# Altium schematic sheet STM32G070RBT6.SchDoc
size A4; SheetNumber: 30; SheetTotal: 32
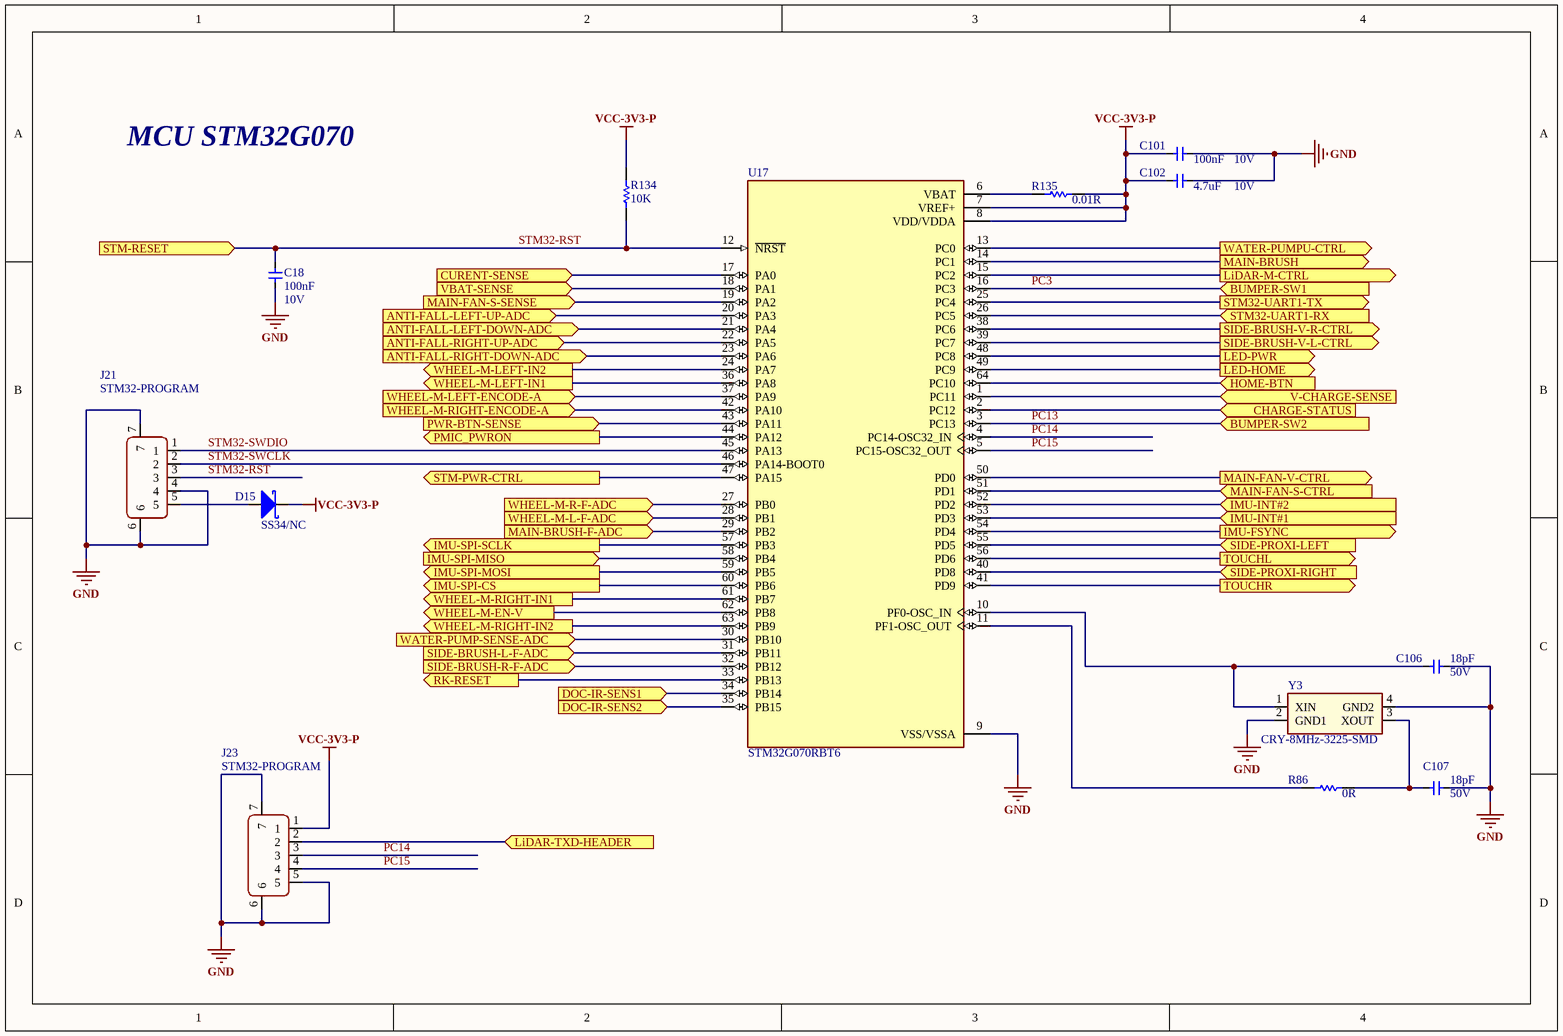
[diagram p0: STM32G070RBT6.SchDoc]

## Parts
C18  100nF  VoltageRate: 10V  [CAP-0402]
C101  100nF  VoltageRate: 10V  [CAP-0402]
C102  4.7uF  VoltageRate: 10V  [CAP-0603]
C106  18pF  VoltageRate: 50V  [CAP-0402]
C107  18pF  VoltageRate: 50V  [CAP-0402]
D15  SS34/NC  [SMA]
J21  STM32-PROGRAM  [HDR1X5]
J23  STM32-PROGRAM  [HDR1X5]
R86  0R  [RES-0402]
R134  10K  [RES-0402]
R135  0.01R  [RES-0805-S]
U17  STM32G070RBT6  [QFP50P1200X1200X160-64N]
Y3  CRY-8MHz-3225-SMD  [X4B250_320H120_SMD]

## Ports
ANTI-FALL-LEFT-DOWN-ADC (in, see Controller-RK3562-TOP[3B], ANTI-FALL-IR-SENSORs[1C]), ANTI-FALL-LEFT-UP-ADC (in, see Controller-RK3562-TOP[4B], ANTI-FALL-IR-SENSORs[1B]), ANTI-FALL-RIGHT-DOWN-ADC (in, see Controller-RK3562-TOP[3B], ANTI-FALL-IR-SENSORs[3C]), ANTI-FALL-RIGHT-UP-ADC (in, see Controller-RK3562-TOP[3B], ANTI-FALL-IR-SENSORs[3B]), BUMPER-SW1 (in, see Controller-RK3562-TOP[4B], DOCKING IR-BUMPER-SENSOR[4B]), BUMPER-SW2 (in, see Controller-RK3562-TOP[4B], DOCKING IR-BUMPER-SENSOR[4C]), CHARGE-STATUS (in, see Controller-RK3562-TOP[4C], BMS-SYSTEM-POWER[1B]), CURENT-SENSE (in, see Controller-RK3562-TOP[4C], BMS-SYSTEM-POWER[7C]), DOC-IR-SENS1 (in, see Controller-RK3562-TOP[4B], DOCKING IR-BUMPER-SENSOR[2B]), DOC-IR-SENS2 (in, see Controller-RK3562-TOP[4B], DOCKING IR-BUMPER-SENSOR[2C]), HOME-BTN (in, see Controller-RK3562-TOP[4C], BUTTON-LEDs [3B]), IMU-FSYNC (out, see Controller-RK3562-TOP[3C], IMU-ICM-4267-P [1C]), IMU-INT#1 (in, see Controller-RK3562-TOP[3C], IMU-ICM-4267-P [1B]), IMU-INT#2 (in, see Controller-RK3562-TOP[3C], IMU-ICM-4267-P [1C]), IMU-SPI-CS (out, see Controller-RK3562-TOP[3C], IMU-ICM-4267-P [1C]), IMU-SPI-MISO (in, see Controller-RK3562-TOP[3C], IMU-ICM-4267-P [1B]), IMU-SPI-MOSI (out, see Controller-RK3562-TOP[3C], IMU-ICM-4267-P [1B]), IMU-SPI-SCLK (out, see Controller-RK3562-TOP[3C], IMU-ICM-4267-P [1B]), LED-HOME (out, see Controller-RK3562-TOP[3C], BUTTON-LEDs [1B]), LED-PWR (out, see Controller-RK3562-TOP[3C], BUTTON-LEDs [1D]), LiDAR-M-CTRL (out, see Controller-RK3562-TOP[4C]), LiDAR-TXD-HEADER (in, see Controller-RK3562-TOP[4C]), MAIN-BRUSH (out, see Controller-RK3562-TOP[3B], MAIN-BRUSH-MOTOR [1C]), MAIN-BRUSH-F-ADC (in, see Controller-RK3562-TOP[3B], MAIN-BRUSH-MOTOR [1B]), MAIN-FAN-S-CTRL (in, see Controller-RK3562-TOP[3C], MAIN-FAN [2C]), MAIN-FAN-S-SENSE (in, see Controller-RK3562-TOP[3C], MAIN-FAN [2C]), MAIN-FAN-V-CTRL (out, see Controller-RK3562-TOP[3C], MAIN-FAN [2B]), PMIC_PWRON (out, see Controller-RK3562-TOP[4C], CONTROLLER-RK3562[1B], RK-POWER-SUPPLY[1A]), PWR-BTN-SENSE (in, see Controller-RK3562-TOP[4C], BMS-SYSTEM-POWER[5D]), RK-RESET (out, see Controller-RK3562-TOP[4B], CONTROLLER-RK3562[7A]), SIDE-BRUSH-L-F-ADC (in, see Controller-RK3562-TOP[3C], SIDE-BRUSH-MOTORs [2C]), SIDE-BRUSH-R-F-ADC (in, see Controller-RK3562-TOP[3C], SIDE-BRUSH-MOTORs [2B]), SIDE-BRUSH-V-L-CTRL (out, see Controller-RK3562-TOP[3C], SIDE-BRUSH-MOTORs [2D]), SIDE-BRUSH-V-R-CTRL (out, see Controller-RK3562-TOP[3C], SIDE-BRUSH-MOTORs [2B]), SIDE-PROXI-LEFT (in, see Controller-RK3562-TOP[4B], SIDE-PROXIMITY-IR-SENSOR [2A]), SIDE-PROXI-RIGHT (in, see Controller-RK3562-TOP[4B], SIDE-PROXIMITY-IR-SENSOR [1C]), STM32-UART1-RX (in, see Controller-RK3562-TOP[4B]), STM32-UART1-TX (out, see Controller-RK3562-TOP[4B]), STM-PWR-CTRL (out, see Controller-RK3562-TOP[4C], BMS-SYSTEM-POWER[7D]), STM-RESET (in, see Controller-RK3562-TOP[4B], CONTROLLER-RK3562[3D], RK3562-VCCIO6[4C]), TOUCHL (out, see Controller-RK3562-TOP[4B], SIDE-PROXIMITY-IR-SENSOR [2B]), TOUCHR (out, see Controller-RK3562-TOP[4B], SIDE-PROXIMITY-IR-SENSOR [2C]), V-CHARGE-SENSE (in, see Controller-RK3562-TOP[4C], BMS-SYSTEM-POWER[8B]), VBAT-SENSE (in, see Controller-RK3562-TOP[4C], BMS-SYSTEM-POWER[7C]), WATER-PUMP-SENSE-ADC (in, see Controller-RK3562-TOP[3B], WATER-PUMP [1C]), WATER-PUMPU-CTRL (out, see Controller-RK3562-TOP[3B], WATER-PUMP [1B]), WHEEL-M-EN-V (out, see Controller-RK3562-TOP[3B], WHEEL-MOTORs [4B]), WHEEL-M-L-F-ADC (in, see Controller-RK3562-TOP[3C], WHEEL-MOTORs [1D]), WHEEL-M-LEFT-ENCODE-A (in, see Controller-RK3562-TOP[3C], WHEEL-MOTORs [2D]), WHEEL-M-LEFT-IN1 (out, see Controller-RK3562-TOP[3B], WHEEL-MOTORs [1C]), WHEEL-M-LEFT-IN2 (out, see Controller-RK3562-TOP[3B], WHEEL-MOTORs [1C]), WHEEL-M-R-F-ADC (in, see Controller-RK3562-TOP[3C], WHEEL-MOTORs [1B]), WHEEL-M-RIGHT-ENCODE-A (in, see Controller-RK3562-TOP[3B], WHEEL-MOTORs [2B]), WHEEL-M-RIGHT-IN1 (out, see Controller-RK3562-TOP[3B], WHEEL-MOTORs [1A]), WHEEL-M-RIGHT-IN2 (out, see Controller-RK3562-TOP[3B], WHEEL-MOTORs [1A])

## Nets
GND: C18.2 C101.1 C102.1 C106.1 C107.1 J21.4 J21.6 J21.7 J23.5 J23.6 J23.7 U17.9(VSS/VSSA) Y3.2(GND1) Y3.4(GND2)
VCC-3V3-P: C101.2 C102.2 D15.2(K) J23.1 R134.1 R135.1 U17.7(VREF+) U17.8(VDD/VDDA)
ANTI-FALL-LEFT-DOWN-ADC: U17.21(PA4) ; port ANTI-FALL-LEFT-DOWN-ADC
ANTI-FALL-LEFT-UP-ADC: U17.20(PA3) ; port ANTI-FALL-LEFT-UP-ADC
ANTI-FALL-RIGHT-DOWN-ADC: U17.23(PA6) ; port ANTI-FALL-RIGHT-DOWN-ADC
ANTI-FALL-RIGHT-UP-ADC: U17.22(PA5) ; port ANTI-FALL-RIGHT-UP-ADC
CHARGE-STATUS: U17.2(PC12) ; port CHARGE-STATUS
CURENT-SENSE: U17.17(PA0) ; port CURENT-SENSE
DOC-IR-SENS1: U17.34(PB14) ; port DOC-IR-SENS1
DOC-IR-SENS2: U17.35(PB15) ; port DOC-IR-SENS2
HOME-BTN: U17.64(PC10) ; port HOME-BTN
IMU-FSYNC: U17.54(PD4) ; port IMU-FSYNC
IMU-INT#1: U17.53(PD3) ; port IMU-INT#1
IMU-INT#2: U17.52(PD2) ; port IMU-INT#2
IMU-SPI-CS: U17.60(PB6) ; port IMU-SPI-CS
IMU-SPI-MISO: U17.58(PB4) ; port IMU-SPI-MISO
IMU-SPI-MOSI: U17.59(PB5) ; port IMU-SPI-MOSI
IMU-SPI-SCLK: U17.57(PB3) ; port IMU-SPI-SCLK
LED-HOME: U17.49(PC9) ; port LED-HOME
LED-PWR: U17.48(PC8) ; port LED-PWR
LiDAR-M-CTRL: U17.15(PC2) ; port LiDAR-M-CTRL
LiDAR-TXD-HEADER: J23.2 ; port LiDAR-TXD-HEADER
MAIN-BRUSH: U17.14(PC1) ; port MAIN-BRUSH
MAIN-BRUSH-F-ADC: U17.29(PB2) ; port MAIN-BRUSH-F-ADC
MAIN-FAN-S-CTRL: U17.51(PD1) ; port MAIN-FAN-S-CTRL
MAIN-FAN-S-SENSE: U17.19(PA2) ; port MAIN-FAN-S-SENSE
MAIN-FAN-V-CTRL: U17.50(PD0) ; port MAIN-FAN-V-CTRL
PC3: U17.16(PC3) ; port BUMPER-SW1
PC13: U17.3(PC13) ; port BUMPER-SW2
PC14: J23.3 U17.4(PC14-OSC32_IN)
PC15: J23.4 U17.5(PC15-OSC32_OUT)
PMIC_PWRON: U17.44(PA12) ; port PMIC_PWRON
PWR-BTN-SENSE: U17.43(PA11) ; port PWR-BTN-SENSE
RK-RESET: U17.33(PB13) ; port RK-RESET
SIDE-BRUSH-L-F-ADC: U17.31(PB11) ; port SIDE-BRUSH-L-F-ADC
SIDE-BRUSH-R-F-ADC: U17.32(PB12) ; port SIDE-BRUSH-R-F-ADC
SIDE-BRUSH-V-L-CTRL: U17.39(PC7) ; port SIDE-BRUSH-V-L-CTRL
SIDE-BRUSH-V-R-CTRL: U17.38(PC6) ; port SIDE-BRUSH-V-R-CTRL
SIDE-PROXI-LEFT: U17.55(PD5) ; port SIDE-PROXI-LEFT
SIDE-PROXI-RIGHT: U17.40(PD8) ; port SIDE-PROXI-RIGHT
STM32-RST: C18.1 J21.3 R134.2 U17.12(~{NRST}) ; port STM-RESET
STM32-SWCLK: J21.2 U17.46(PA14-BOOT0)
STM32-SWDIO: J21.1 U17.45(PA13)
STM32-UART1-RX: U17.26(PC5) ; port STM32-UART1-RX
STM32-UART1-TX: U17.25(PC4) ; port STM32-UART1-TX
STM-PWR-CTRL: U17.47(PA15) ; port STM-PWR-CTRL
TOUCHL: U17.56(PD6) ; port TOUCHL
TOUCHR: U17.41(PD9) ; port TOUCHR
V-CHARGE-SENSE: U17.1(PC11) ; port V-CHARGE-SENSE
VBAT-SENSE: U17.18(PA1) ; port VBAT-SENSE
WATER-PUMP-SENSE-ADC: U17.30(PB10) ; port WATER-PUMP-SENSE-ADC
WATER-PUMPU-CTRL: U17.13(PC0) ; port WATER-PUMPU-CTRL
WHEEL-M-EN-V: U17.62(PB8) ; port WHEEL-M-EN-V
WHEEL-M-L-F-ADC: U17.28(PB1) ; port WHEEL-M-L-F-ADC
WHEEL-M-LEFT-ENCODE-A: U17.37(PA9) ; port WHEEL-M-LEFT-ENCODE-A
WHEEL-M-LEFT-IN1: U17.36(PA8) ; port WHEEL-M-LEFT-IN1
WHEEL-M-LEFT-IN2: U17.24(PA7) ; port WHEEL-M-LEFT-IN2
WHEEL-M-R-F-ADC: U17.27(PB0) ; port WHEEL-M-R-F-ADC
WHEEL-M-RIGHT-ENCODE-A: U17.42(PA10) ; port WHEEL-M-RIGHT-ENCODE-A
WHEEL-M-RIGHT-IN1: U17.61(PB7) ; port WHEEL-M-RIGHT-IN1
WHEEL-M-RIGHT-IN2: U17.63(PB9) ; port WHEEL-M-RIGHT-IN2
NetC106_2: C106.2 U17.10(PF0-OSC_IN) Y3.1(XIN)
NetC107_2: C107.2 R86.2 Y3.3(XOUT)
NetD15_1: D15.1(A) J21.5
NetR86_1: R86.1 U17.11(PF1-OSC_OUT)
NetR135_2: R135.2 U17.6(VBAT)

## Notes on the sheet
- MCU STM32G070

## Library data of the parts
C18 C101 C102 C106 C107 = Capacitor-1: ManufacturingPartNumber: *; Manufacturer: *; SupplierPartNumber: *; Supplier: *
D15 = DIODE-2: ManufacturingPartNumber: *; Manufacturer: *; SupplierPartNumber: *; Supplier: *; VoltageRate: *
J21 J23 = HDRx5: ManufacturingPartNumber: *; Manufacturer: *; SupplierPartNumber: *; Supplier: *; VoltageRate: *
R86 R134 R135 = Resistor-1: ManufacturingPartNumber: *; Manufacturer: *; SupplierPartNumber: *; Supplier: *; VoltageRate: *
Y3 = CRY-24MHz-3225-SMD_0: ManufacturingPartNumber: *; Manufacturer: *; SupplierPartNumber: *; Supplier: *; VoltageRate: *
U17 = STM32G070RBT6: ManufacturingPartNumber: *; Manufacturer: *; SupplierPartNumber: *; Supplier: *; VoltageRate: *